# EAGLE schematic GS001 (EAGLE 9.5.2)
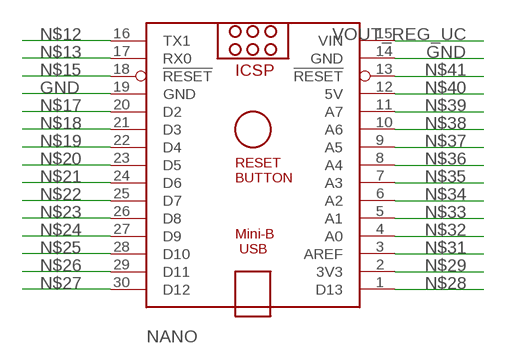
[diagram p0: schematic, sheet 1, part 1 of 2]
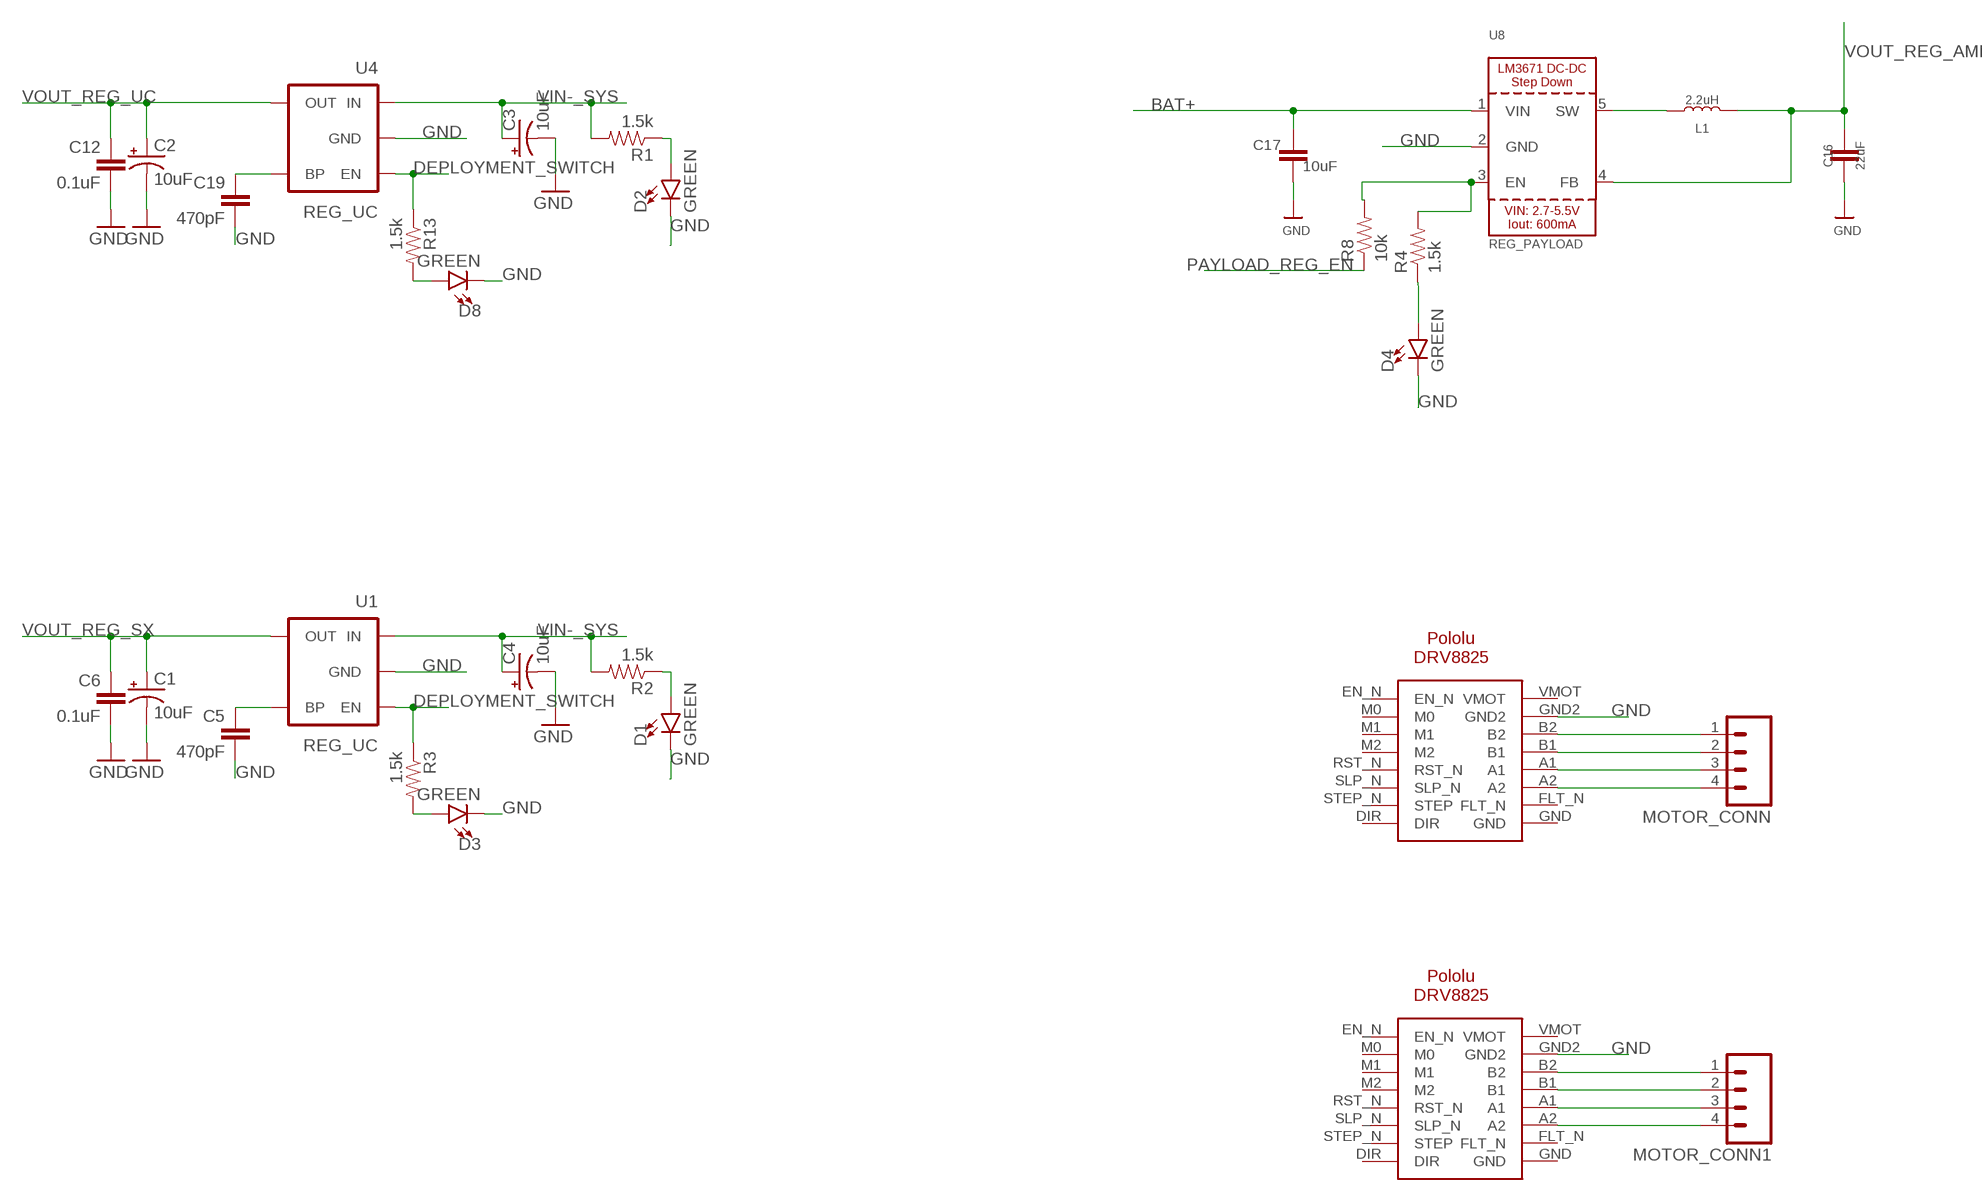
[diagram p1: schematic, sheet 1, part 2 of 2]

## Parts
C1  10uF  10UF-POLAR-0603-6.3V-20%(TANT)  [0603-POLAR]
C2  10uF  10UF-POLAR-0603-6.3V-20%(TANT)  [0603-POLAR]
C3  10uF  10UF-POLAR-0603-6.3V-20%(TANT)  [0603-POLAR]
C4  10uF  10UF-POLAR-0603-6.3V-20%(TANT)  [0603-POLAR]
C5  470pF  CAP0603-CAP  [0603-CAP]
C6  0.1uF  CAP0603-CAP  [0603-CAP]
C12  0.1uF  CAP0603-CAP  [0603-CAP]
C16  22uF  10UF-0603-6.3V-20%  [0603]
C17  10uF  10UF-0603-6.3V-20%  [0603]
C19  470pF  CAP0603-CAP  [0603-CAP]
D1  GREEN  LED-GREEN0603  [LED-0603]
D2  GREEN  LED-GREEN0603  [LED-0603]
D3  GREEN  LED-GREEN0603  [LED-0603]
D4  GREEN  LED-GREEN0603  [LED-0603]
D8  GREEN  LED-GREEN0603  [LED-0603]
L1  2.2uH  INDUCTOR-0603-33NH  [0603]
MOTOR_CONN  M04  [04P]
MOTOR_CONN1  M04  [04P]
NANO  ARDUINO_NANO  [ARDUINO_NANO]
R1  1.5k  RESISTOR0603-RES  [0603-RES]
R2  1.5k  RESISTOR0603-RES  [0603-RES]
R3  1.5k  RESISTOR0603-RES  [0603-RES]
R4  1.5k  RESISTOR0603-RES  [0603-RES]
R8  10k  RESISTOR0402-RES  [0402-RES]
R13  1.5k  RESISTOR0603-RES  [0603-RES]
U1  REG_UC  V_REG_LDOSMD  [SOT23-5]
U4  REG_UC  V_REG_LDOSMD  [SOT23-5]
U8  REG_PAYLOAD  VREG_LM3671  [SOT23-5]
U$1  POLOLU-DRV8825  [POLOLU-DRV8825]
U$4  POLOLU-DRV8825  [POLOLU-DRV8825]

## Nets
BAT+: C17.1 U8.1(VIN)
DEPLOYMENT_SWITCH: R3.1 R13.1 U1.3(EN) U4.3(EN)
GND: C1.- C2.- C3.- C4.- C5.2 C6.2 C12.2 C16.2 C17.2 C19.2 D1.C D2.C D3.C D4.C D8.C NANO.14(GND) NANO.19(GND) U1.2(GND) U4.2(GND) U8.2(GND) U$1.GND2 U$4.GND2
N$1: C5.1 U1.4(BP)
N$2: D8.A R13.2
N$3: D3.A R3.2
N$4: D1.A R2.1
N$5: MOTOR_CONN.1 U$1.B2
N$6: D4.A R4.1
N$7: D2.A R1.1
N$8: MOTOR_CONN.2 U$1.B1
N$9: R4.2 R8.2 U8.3(EN)
N$10: MOTOR_CONN.3 U$1.A1
N$11: MOTOR_CONN.4 U$1.A2
N$12: NANO.16(TX1)
N$13: NANO.17(RX0)
N$14: L1.1 U8.5(SW)
N$15: NANO.18(!RESET)
N$16: MOTOR_CONN1.1 U$4.B2
N$17: NANO.20(D2)
N$18: NANO.21(D3)
N$19: NANO.22(D4)
N$20: NANO.23(D5)
N$21: NANO.24(D6)
N$22: NANO.25(D7)
N$23: NANO.26(D8)
N$24: NANO.27(D9)
N$25: NANO.28(D10)
N$26: NANO.29(D11)
N$27: NANO.30(D12)
N$28: NANO.1(D13)
N$29: NANO.2(3V3)
N$30: C19.1 U4.4(BP)
N$31: NANO.3(AREF)
N$32: NANO.4(A0)
N$33: NANO.5(A1)
N$34: NANO.6(A2)
N$35: NANO.7(A3)
N$36: NANO.8(A4)
N$37: NANO.9(A5)
N$38: NANO.10(A6)
N$39: NANO.11(A7)
N$40: NANO.12(5V)
N$41: NANO.13(!RESET)
N$42: MOTOR_CONN1.2 U$4.B1
N$43: MOTOR_CONN1.3 U$4.A1
N$44: MOTOR_CONN1.4 U$4.A2
PAYLOAD_REG_EN: R8.1
VIN-_SYS: C3.+ C4.+ R1.2 R2.2 U1.1(IN) U4.1(IN)
VOUT_REG_AMP: C16.1 L1.2 U8.4(FB)
VOUT_REG_SX: C1.+ C6.1 U1.5(OUT)
VOUT_REG_UC: C2.+ C12.1 NANO.15(VIN) U4.5(OUT)
Unconnected: U$1.DIR U$1.EN_N U$1.FLT_N U$1.GND U$1.M0 U$1.M1 U$1.M2 U$1.RST_N U$1.SLP_N U$1.STEP_N(STEP) U$1.VMOT U$4.DIR U$4.EN_N U$4.FLT_N U$4.GND U$4.M0 U$4.M1 U$4.M2 U$4.RST_N U$4.SLP_N U$4.STEP_N(STEP) U$4.VMOT

## Library data of the parts
C1-C4 = SparkFun-Capacitors:10UF-POLAR: 10.0µF polarized capacitors A capacitor is a passive two-terminal electrical component used to store electrical energy temporarily in an electric field.; PROD_ID: CAP-13210
C5 C6 C12 C19 = SparkFun:CAP: Capacitor Standard 0603 ceramic capacitor, and 0.1" leaded capacitor.
C16 = SparkFun-Capacitors:10UF: 10.0µF ceramic capacitors A capacitor is a passive two-terminal electrical component used to store electrical energy temporarily in an electric field.; PROD_ID: CAP-11015; VALUE: 10uF
C17 = SparkFun-Capacitors:10UF: 10.0µF ceramic capacitors A capacitor is a passive two-terminal electrical component used to store electrical energy temporarily in an electric field.; PROD_ID: CAP-11015
D1-D4 D8 = SparkFun-LED:LED-GREEN: Green SMD LED Used in manufacturing of various products at SparkFun Packages: 0603 - SMD 0603 package [Product Link] <http://www.futureelectronics.com/en/technologies/semiconductors/optoelectronics/leds/Pages/9894312-LTST-C190GKT.aspx?CrossPart=HSMG-C190&IM=0> LilyPad 1206 - SMD1206 LilyPad package [Product Link] <http://www.futureelectronics.com/en/Technologies/Product.aspx?ProductID=IN150NGHARVATEKCORPORATION2049943&IM=0> 1206 - SMD1206 package [Product Link] <http://www.futureelectronics.com/en/technologies/semiconductors/optoelectronics/leds/Pages/8315665-LTST-C150KGKT.aspx?IM=0> 1206 Bottom Mount -SMD 1206 Bottom Mount [Product Link] <http://www.digikey.com/product-detail/en/lite-on-inc/LTST-C230KGKT/160-1456-1-ND/386854> SparkFun Products: Pro Mini 328 -5V <https://www.sparkfun.com/products/821> RedBoard <https://www.sparkfun.com/products/12757> MP3 Trigger <https://www.sparkfun.com/products/13720> Makey Makey <https://www.sparkfun.com/products/11076>; PROD_ID: DIO-00821
L1 = SparkFun-Coils:INDUCTOR: Inductors Resist changes in electrical current. Basically a coil of wire. SparkFun Products: SparkFun Load Cell Amplifier - HX711 <https://www.sparkfun.com/products/13879> IOIO-OTG - V2.2 <https://www.sparkfun.com/products/13613>; PROD_ID: NDUC-07874; VALUE: 33nH/±5%/500mA
MOTOR_CONN MOTOR_CONN1 = con-amp-quick:M04: AMP QUICK CONNECTOR; OC_FARNELL: unknown; OC_NEWARK: unknown
NANO = ArduinoNanoV30:ARDUINO_NANO: Arduino Nano V3.0 Overview: The Arduino Nano is a small, complete, and breadboard-friendly board based on the ATmega328 (Arduino Nano 3.x) or ATmega168 (Arduino Nano 2.x). It has more or less the same functionality of the Arduino Duemilanove, but in a different package. It lacks only a DC power jack, and works with a Mini-B USB cable instead of a standard one. The Nano was designed and is being produced by Gravitech. Specifications: Microcontroller Atmel ATmega168 or ATmega328 Operating Voltage (logic level) 5 V Input Voltage (recommended) 7-12 V Input Voltage (limits) 6-20 V Digital I/O Pins 14 (of which 6 provide PWM output) Analog Input Pins 8 DC Current per I/O Pin 40 mA Flash Memory 16 KB (ATmega168) or 32 KB (ATmega328) of which 2 KB used by bootloader SRAM 1 KB (ATmega168) or 2 KB (ATmega328) EEPROM 512 bytes (ATmega168) or 1 KB (ATmega328) Clock Speed 16 MHz Dimensions 0.73" x 1.70" Length 45 mm Width 18 mm Weigth 5 g Power: The Arduino Nano can be powered via the Mini-B USB connection, 6-20V unregulated external power supply (pin 30), or 5V regulated external power supply (pin 27). The power source is automatically selected to the highest voltage source. Memory: The ATmega168 has 16 KB of flash memory for storing code (of which 2 KB is used for the bootloader); the ATmega328 has 32 KB, (also with 2 KB used for the bootloader). The ATmega168 has 1 KB of SRAM and 512 bytes of EEPROM (which can be read and written with the EEPROM library); the ATmega328 has 2 KB of SRAM and 1 KB of EEPROM. Input and Output: Each of the 14 digital pins on the Nano can be used as an input or output, using pinMode(), digitalWrite(), and digitalRead() functions. They operate at 5 volts. Each pin can provide or receive a maximum of 40 mA and has an internal pull-up resistor (disconnected by default) of 20-50 kOhms. In addition, some pins have specialized functions. Visit Arduino - ArduinoBoardNano <https://www.arduino.cc/en/Main/ArduinoBoardNano>
R1-R4 R8 R13 = SparkFun:RESISTOR: Resistor Basic schematic elements and footprints for 0603, 1206, and PTH resistors.
U1 U4 = SparkFun:V_REG_LDO: Voltage Regulator LDO Standard 150mA LDO voltage regulator in SOT-23 layout. Micrel part MIC5205. BP (by-pass) pin is used to lower output noise with 470pF cap.
U8 = microbuilder:VREG_LM3671: LM3671 - 600mA DC-DC Step-Down Converter VIN: 2.7-5.5V Load Current: 600mA Switching Frequency: 2MHz Iq: 16uA
U$1 U$4 = alvarop-lib:POLOLU-DRV8825